# EAGLE design Detector_screws (EAGLE 5.11)
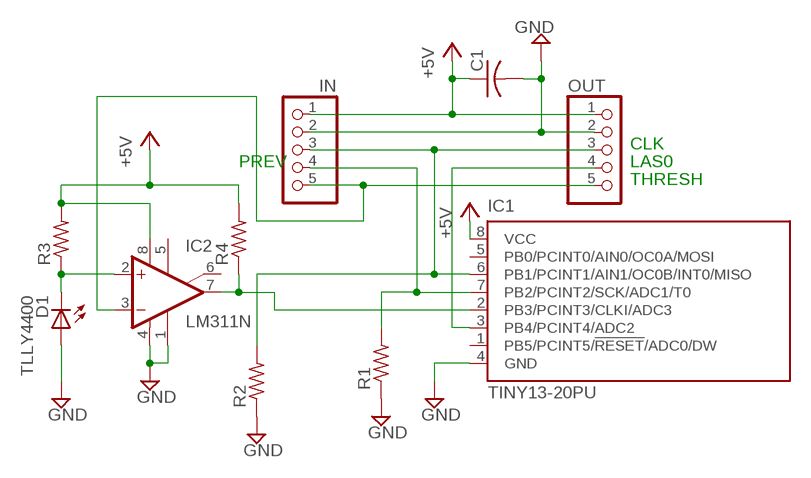
[diagram p0: schematic, sheet 1]

## Parts
C1  C-US025-025X050  [C025-025X050]
D1  TLLY4400  [LED3MM]
IC1  TINY13-20PU  [DIL08]
IC2  LM311N  [DIL08]
IN  PINHD-1X5  [1X05]
OUT  PINHD-1X5  [1X05]
R1  R-US_0207/10  [0207/10]
R2  R-US_0207/10  [0207/10]
R3  R-US_0207/10  [0207/10]
R4  R-US_0207/10  [0207/10]

## Nets
+5V: C1.1 IC1.8(VCC) IC2.8(V+) IN.1 OUT.1 R3.2 R4.2
GND: C1.2 D1.A IC1.4(GND) IC2.1(GND) IC2.4(V-) IN.2 OUT.2 R1.1 R2.1
N$1: IC1.7(PB2/PCINT2/SCK/ADC1/T0) IN.4 R1.2
N$3: IC1.3(PB4/PCINT4/ADC2) OUT.4
N$4: IC1.2(PB3/PCINT3/CLKI/ADC3) IC2.7(OUT) R4.1
N$5: D1.K(C) IC2.2(+IN) R3.1
N$6: IC2.3(-IN) IN.5 OUT.5
N$8: IC1.6(PB1/PCINT1/AIN1/OC0B/INT0/MISO) IN.3 OUT.3 R2.2
Unconnected: IC1.1(PB5/PCINT5/!RESET!/ADC0/DW) IC1.5(PB0/PCINT0/AIN0/OC0A/MOSI) IC2.5(ON) IC2.6(ON/STR)

## Notes on the sheet
- CLK
- PREV | LAS0
- THRESH

## Library data of the parts
C1 = rcl:C-US: CAPACITOR, American symbol
D1 = led:TLLY4400: Low Current (2mA) LED 3 mm Tinted Diffused Package color YELLOW Source: Data sheet <http://www.farnell.com/datasheets/391098.pdf>; MF: VISHAY SEMICONDUCTOR; OC_FARNELL: 1612439
IC1 = atmel:TINY13: 8-bit AVR Microcontroller with 1K Bytes In-System Programmable Flash Source: http://www.atmel.com/dyn/resources/prod_documents/2535S.pdf; MPN: ATTINY13-20PU; OC_FARNELL: 9171550; OC_NEWARK: 96K6521
IC2 = linear:LM311: COMPARATOR
IN OUT = pinhead:PINHD-1X5: PIN HEADER
R1-R4 = rcl:R-US_: RESISTOR, American symbol

## Board
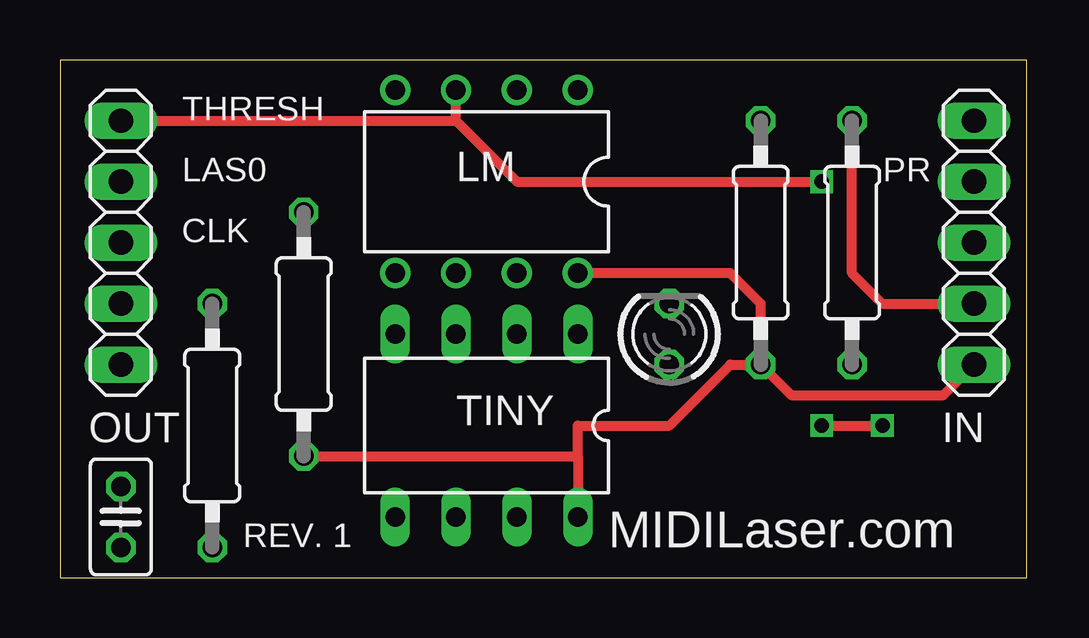
[diagram p1: board, top side]
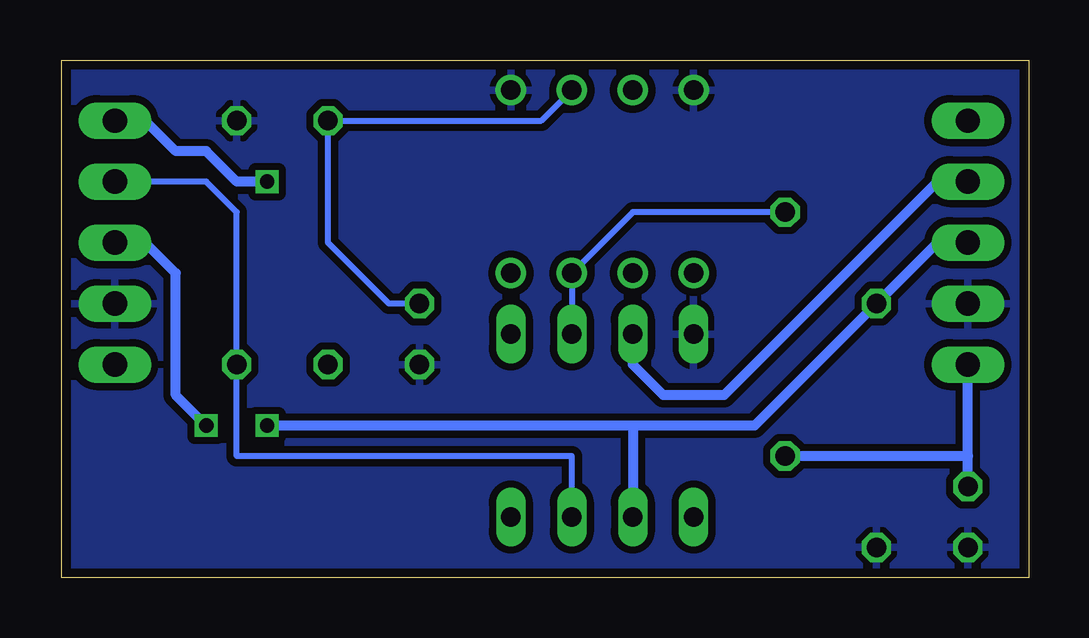
[diagram p2: board, bottom side, seen from below]

Size 40.31 x 21.58 mm. Coordinates in mm from the lower left corner, seen from the top.
Outline: 0,0 40.31,0 40.31,21.58 0,21.58 0,0
Copper layers (1*16): Top 0.0356mm / dielectric 1.5011mm / Bottom 0.0356mm
Design rules "LaenPCBOrder": minimum track width 6mil, minimum drill 13mil, track to track 6mil, track to pad 6mil, pad to pad 6mil, via to via 6mil, smd to smd 6mil, copper to edge 15mil, drill to drill 6mil, minimum pad ring 7mil, minimum via ring 7mil, stop-mask expansion 4mil, vias tented up to drill 0mil, thermal gap 10mil

### Footprints (pad centres in the part's own frame; a part is rotated, then mirrored left to right if it is on the bottom)
C025-025X050 = drill 0.813 octagon: 1 -1.27,0; 2 1.27,0
LED3MM = drill 0.813 octagon: A -1.27,0; K 1.27,0
DIL08 = drill 0.813 long: 1 -3.81,-3.81; 2 -1.27,-3.81; 3 1.27,-3.81; 4 3.81,-3.81; 5 3.81,3.81; 6 1.27,3.81; 7 -1.27,3.81; 8 -3.81,3.81
DIL08' = drill 0.813 pad 1.27 round: 1 -3.81,-3.81; 2 -1.27,-3.81; 3 1.27,-3.81; 4 3.81,-3.81; 5 3.81,3.81; 6 1.27,3.81; 7 -1.27,3.81; 8 -3.81,3.81
1X05 = drill 1.016 long: 1 -5.08,0; 2 -2.54,0; 3 0,0; 4 2.54,0; 5 5.08,0
0207/10 = drill 0.813 octagon: 1 -5.08,0; 2 5.08,0

### Placement (x,y rotation side)
C1  2.54,2.54 270 top
D1  25.4,10.16 90 top
IC1  17.78,6.35 180 top
IC2  LM311N  [DIL08']  17.78,16.51 180 top
IN  38.1,13.97 90 top
OUT  2.54,13.97 90 top
R1  33.02,13.97 270 top
R2  6.35,6.35 90 top
R3  29.21,13.97 270 top
R4  10.16,10.16 270 top

### Tracks (layer width: path | path; a pad name or v marks a point on that pad's centre or on a via)
+5V
  Top 0.406: IC2.8 27.94,12.7 29.21,11.43 R3.2 | R3.2 30.48,7.62 36.83,7.62 IN.1 | R4.2 21.59,5.08 | 21.59,5.08 IC1.8 | 21.59,5.08 21.59,6.35 25.4,6.35 27.94,8.89 R3.2
  Bottom 0.406: 2.54,5.08 OUT.1 | C1.1 2.54,5.08 | 2.54,5.08 R4.2
GND
  Top 0.406: R1.1 33.02,12.7 34.29,11.43 IN.2
  pour Bottom (isolate 0.305): 0,21.59 40.64,21.59 40.64,0 0,0
N$1
  Bottom 0.254: IC1.7 19.05,5.08 33.02,5.08 R1.2 33.02,15.24 34.29,16.51 IN.4
N$3
  Bottom 0.406: OUT.4 3.81,16.51 12.7,7.62 15.24,7.62 16.51,8.89 IC1.3
N$4
  Bottom 0.254: R4.1 16.51,15.24 IC2.7 IC1.2
N$5
  Bottom 0.254: D1.K 26.67,11.43 29.21,13.97 R3.1 20.32,19.05 IC2.2
N$6  (via drill 0.6)
  Top 0.406: OUT.5 16.51,19.05 | 16.51,19.05 IC2.3 | 16.51,19.05 19.05,16.51 v31.75,16.51
  Bottom 0.406: v31.75,16.51 33.02,16.51 34.29,17.78 35.56,17.78 36.83,19.05 IN.5
N$8  (via drill 0.6)
  Top 0.406: v31.75,6.35 v34.29,6.35
  Bottom 0.406: OUT.3 3.81,13.97 R2.2 11.43,6.35 16.51,6.35 | 16.51,6.35 IC1.6 | 16.51,6.35 v31.75,6.35 | v34.29,6.35 35.56,7.62 35.56,12.7 36.83,13.97 IN.3

### Text on the board
tPlace: THRESH | LAS0 | LM | PR | CLK | TINY | REV. 1 | MIDILaser.com